# Altium schematic sheet Sheet_2.schdoc
size 300 x 194 mm
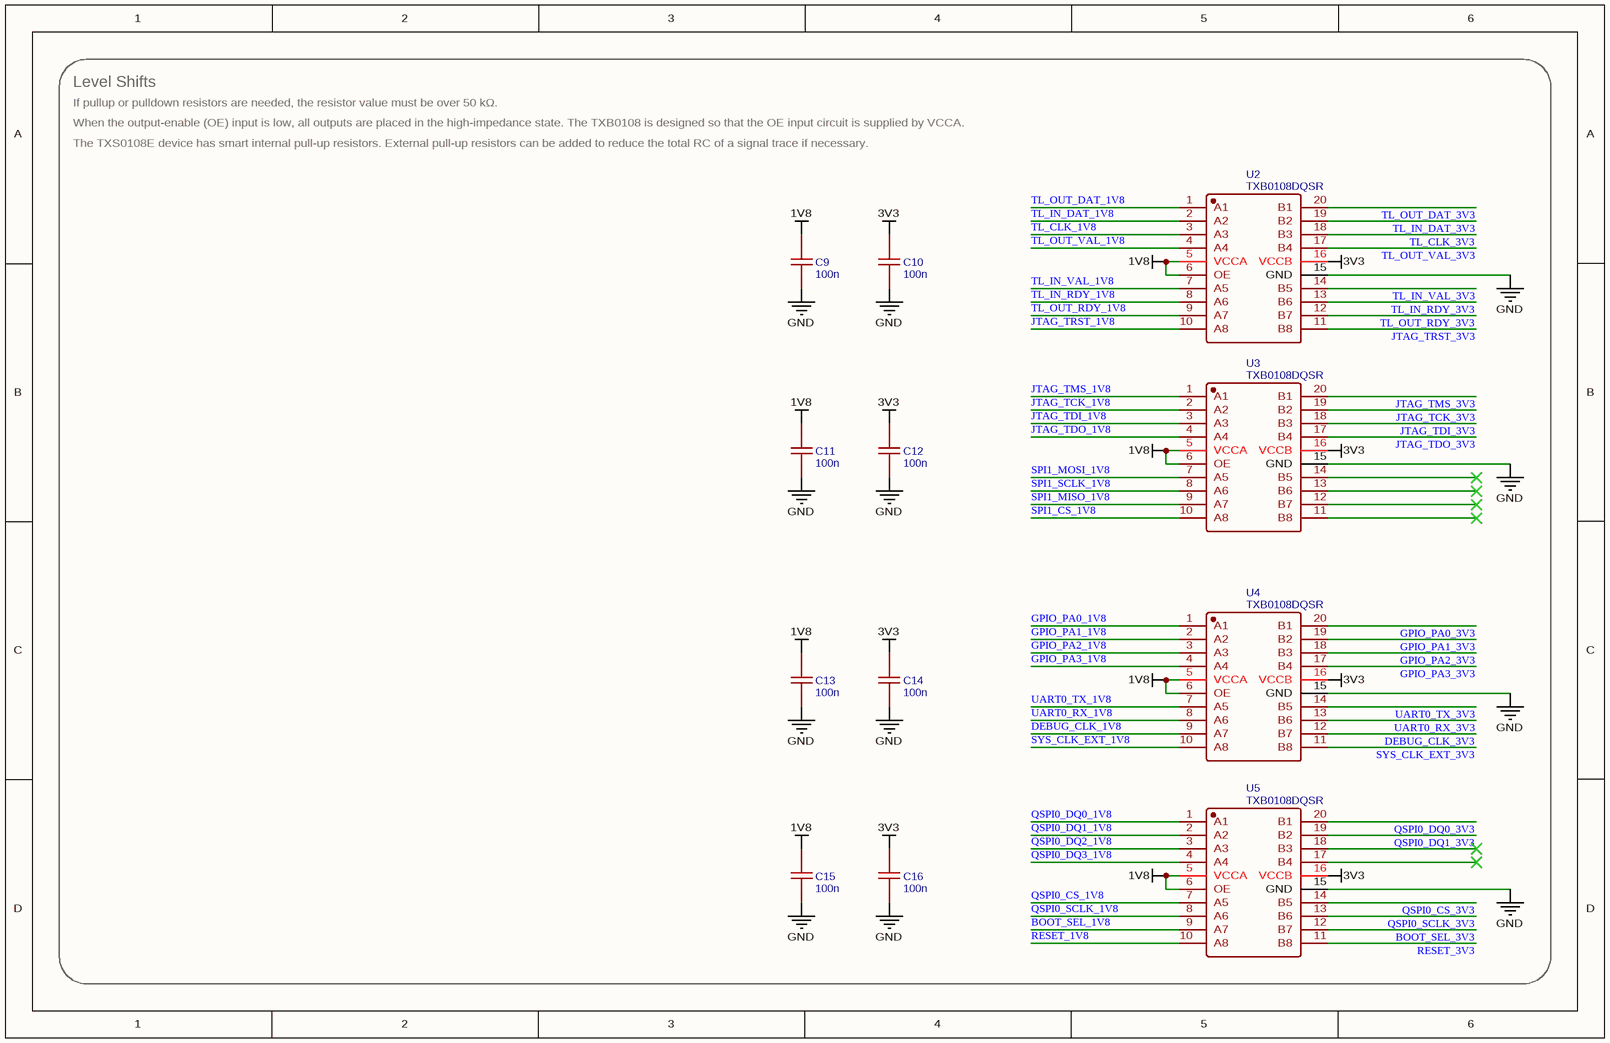
[diagram p0: Sheet_2.schdoc]

## Parts
C9  100n  [CAPA-0402]
C10  100n  [CAPA-0402]
C11  100n  [CAPA-0402]
C12  100n  [CAPA-0402]
C13  100n  [CAPA-0402]
C14  100n  [CAPA-0402]
C15  100n  [CAPA-0402]
C16  100n  [CAPA-0402]
U2  TXB0108DQSR  [SON-20_L4.0-W2.0-P0.40-BL]
U3  TXB0108DQSR  [SON-20_L4.0-W2.0-P0.40-BL]
U4  TXB0108DQSR  [SON-20_L4.0-W2.0-P0.40-BL]
U5  TXB0108DQSR  [SON-20_L4.0-W2.0-P0.40-BL]

## Nets
1V8: C9.2 C11.2 C13.2 C15.2 U2.5(VCCA) U2.6(OE) U3.5(VCCA) U3.6(OE) U4.5(VCCA) U4.6(OE) U5.5(VCCA) U5.6(OE)
3V3: C10.2 C12.2 C14.2 C16.2 U2.16(VCCB) U3.16(VCCB) U4.16(VCCB) U5.16(VCCB)
GND: C9.1 C10.1 C11.1 C12.1 C13.1 C14.1 C15.1 C16.1 U2.15(GND) U3.15(GND) U4.15(GND) U5.15(GND)
BOOT_SEL_1V8: U5.9(A7)
BOOT_SEL_3V3: U5.12(B7)
DEBUG_CLK_1V8: U4.9(A7)
DEBUG_CLK_3V3: U4.12(B7)
GPIO_PA0_1V8: U4.1(A1)
GPIO_PA0_3V3: U4.20(B1)
GPIO_PA1_1V8: U4.2(A2)
GPIO_PA1_3V3: U4.19(B2)
GPIO_PA2_1V8: U4.3(A3)
GPIO_PA2_3V3: U4.18(B3)
GPIO_PA3_1V8: U4.4(A4)
GPIO_PA3_3V3: U4.17(B4)
JTAG_TCK_1V8: U3.2(A2)
JTAG_TCK_3V3: U3.19(B2)
JTAG_TDI_1V8: U3.3(A3)
JTAG_TDI_3V3: U3.18(B3)
JTAG_TDO_1V8: U3.4(A4)
JTAG_TDO_3V3: U3.17(B4)
JTAG_TMS_1V8: U3.1(A1)
JTAG_TMS_3V3: U3.20(B1)
JTAG_TRST_1V8: U2.10(A8)
JTAG_TRST_3V3: U2.11(B8)
QSPI0_CS_1V8: U5.7(A5)
QSPI0_CS_3V3: U5.14(B5)
QSPI0_DQ0_1V8: U5.1(A1)
QSPI0_DQ0_3V3: U5.20(B1)
QSPI0_DQ1_1V8: U5.2(A2)
QSPI0_DQ1_3V3: U5.19(B2)
QSPI0_DQ2_1V8: U5.3(A3)
QSPI0_DQ3_1V8: U5.4(A4)
QSPI0_SCLK_1V8: U5.8(A6)
QSPI0_SCLK_3V3: U5.13(B6)
RESET_1V8: U5.10(A8)
RESET_3V3: U5.11(B8)
SPI1_CS_1V8: U3.10(A8)
SPI1_MISO_1V8: U3.9(A7)
SPI1_MOSI_1V8: U3.7(A5)
SPI1_SCLK_1V8: U3.8(A6)
SYS_CLK_EXT_1V8: U4.10(A8)
SYS_CLK_EXT_3V3: U4.11(B8)
TL_CLK_1V8: U2.3(A3)
TL_CLK_3V3: U2.18(B3)
TL_IN_DAT_1V8: U2.2(A2)
TL_IN_DAT_3V3: U2.19(B2)
TL_IN_RDY_1V8: U2.8(A6)
TL_IN_RDY_3V3: U2.13(B6)
TL_IN_VAL_1V8: U2.7(A5)
TL_IN_VAL_3V3: U2.14(B5)
TL_OUT_DAT_1V8: U2.1(A1)
TL_OUT_DAT_3V3: U2.20(B1)
TL_OUT_RDY_1V8: U2.9(A7)
TL_OUT_RDY_3V3: U2.12(B7)
TL_OUT_VAL_1V8: U2.4(A4)
TL_OUT_VAL_3V3: U2.17(B4)
UART0_RX_1V8: U4.8(A6)
UART0_RX_3V3: U4.13(B6)
UART0_TX_1V8: U4.7(A5)
UART0_TX_3V3: U4.14(B5)

Not connected (* = marked no-connect by the designer): U3 11(B8)* 12(B7)* 13(B6)* 14(B5)*; U5 17(B4)* 18(B3)*

## Notes on the sheet
- If pullup or pulldown resistors are needed, the resistor value must be over 50 kΩ.
- Level Shifts
- The TXS0108E device has smart internal pull-up resistors. External pull-up resistors can be added to reduce the total RC of a signal trace if necessary.
- When the output-enable (OE) input is low, all outputs are placed in the high-impedance state. The TXB0108 is designed so that the OE input circuit is supplied by VCCA.

## Library data of the parts
C9-C16 = 100n: BOM_Manufacturer Part: CL05B104KB54PNC; BOM_Manufacturer: SAMSUNG; nameAlias: Value(F); BOM_Supplier Part: C307331; BOM_Supplier: LCSC; link: https://atta.szlcsc.com//upload/public/pdf/source/20160103/1457707735223.pdf; spicePre: C; spiceSymbolName: CAPA-0402_100n
U2-U5 = TXB0108DQSR: BOM_Manufacturer: TI; BOM_Supplier: LCSC; BOM_Manufacturer Part: TXB0108DQSR; BOM_Supplier Part: C427057; BOM_JLCPCB Part Class: Extended Part; link: https://www.ti.com/lit/ds/symlink/txb0108.pdf?HQS=dis-mous-null-mousermode-dsf-pf-null-wwe; spicePre: U; spiceSymbolName: TXB0108DQSR